# EasyEDA Pro project Arduino SDI.eprj

# Schematic Schematic1

## Sheets
1 SDI: Create Date: 2023-01-01; Page Name: SDI; Project Name: Arduino SDI; Schematic Name: Schematic1; Update Date: 2023-01-05; Add into BOM: yes; Convert to PCB: yes
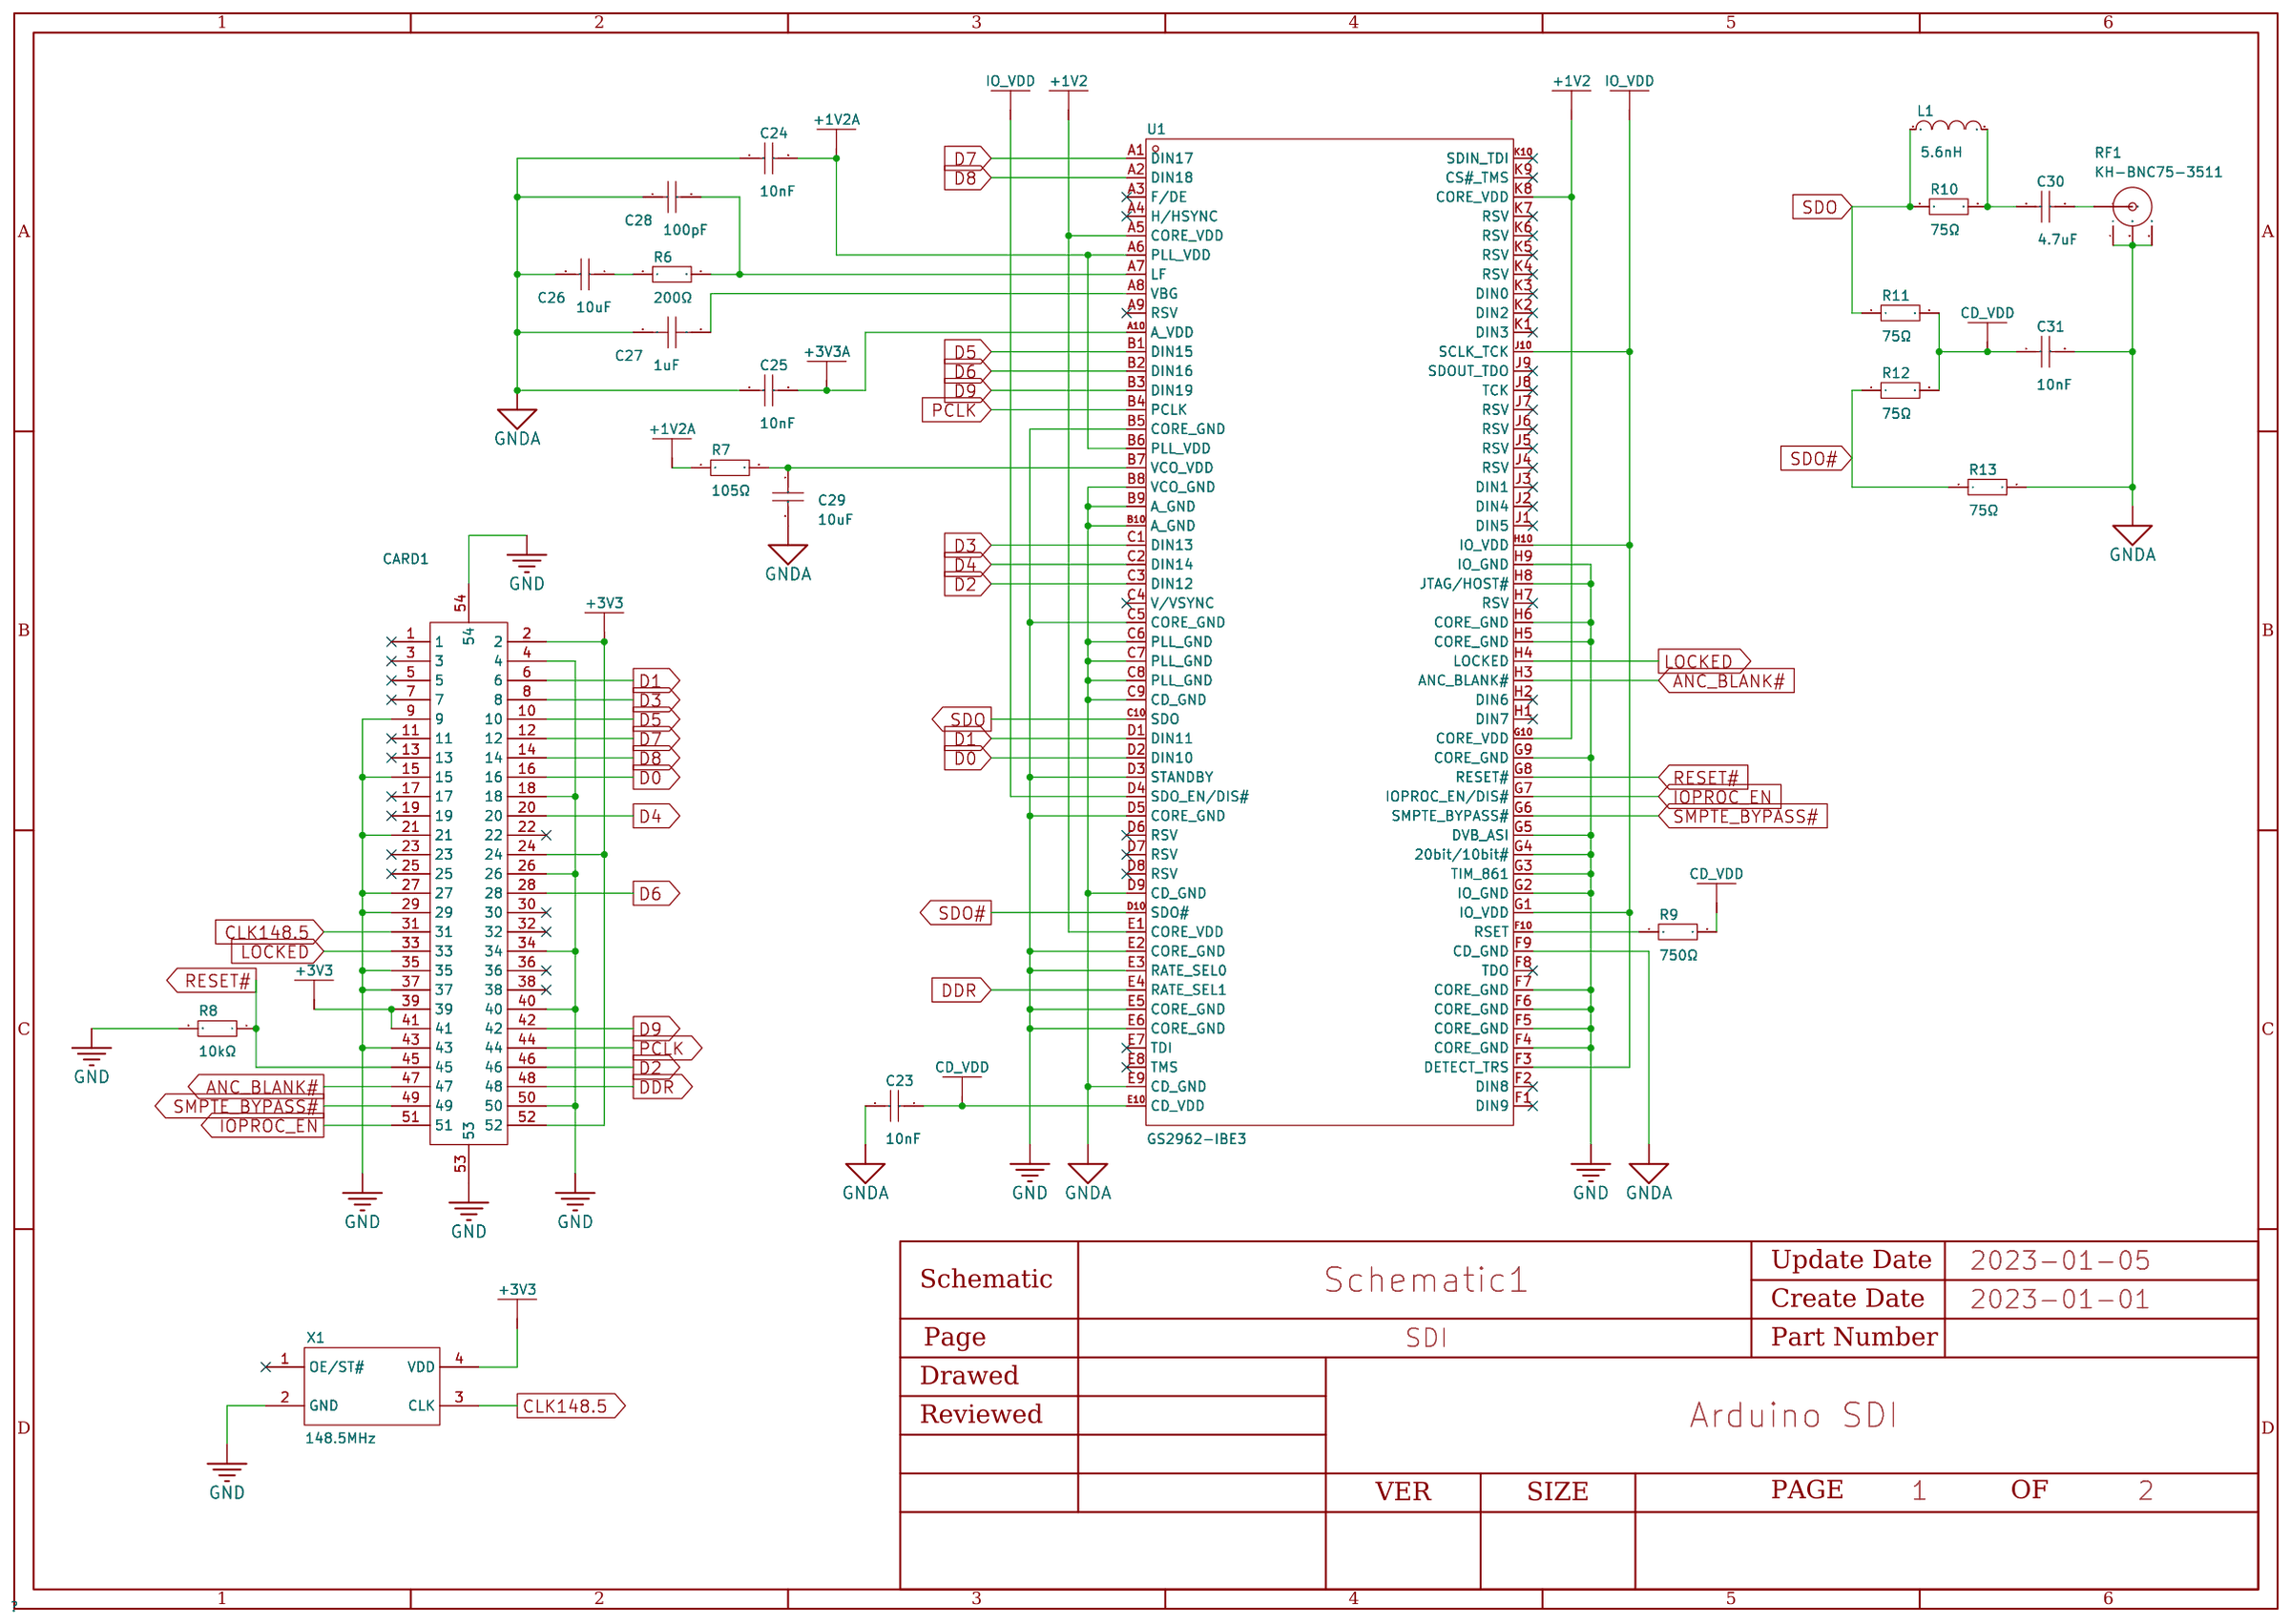
[diagram p0: SDI]
2 Power: Page Name: Power; Update Date: 2023-01-02
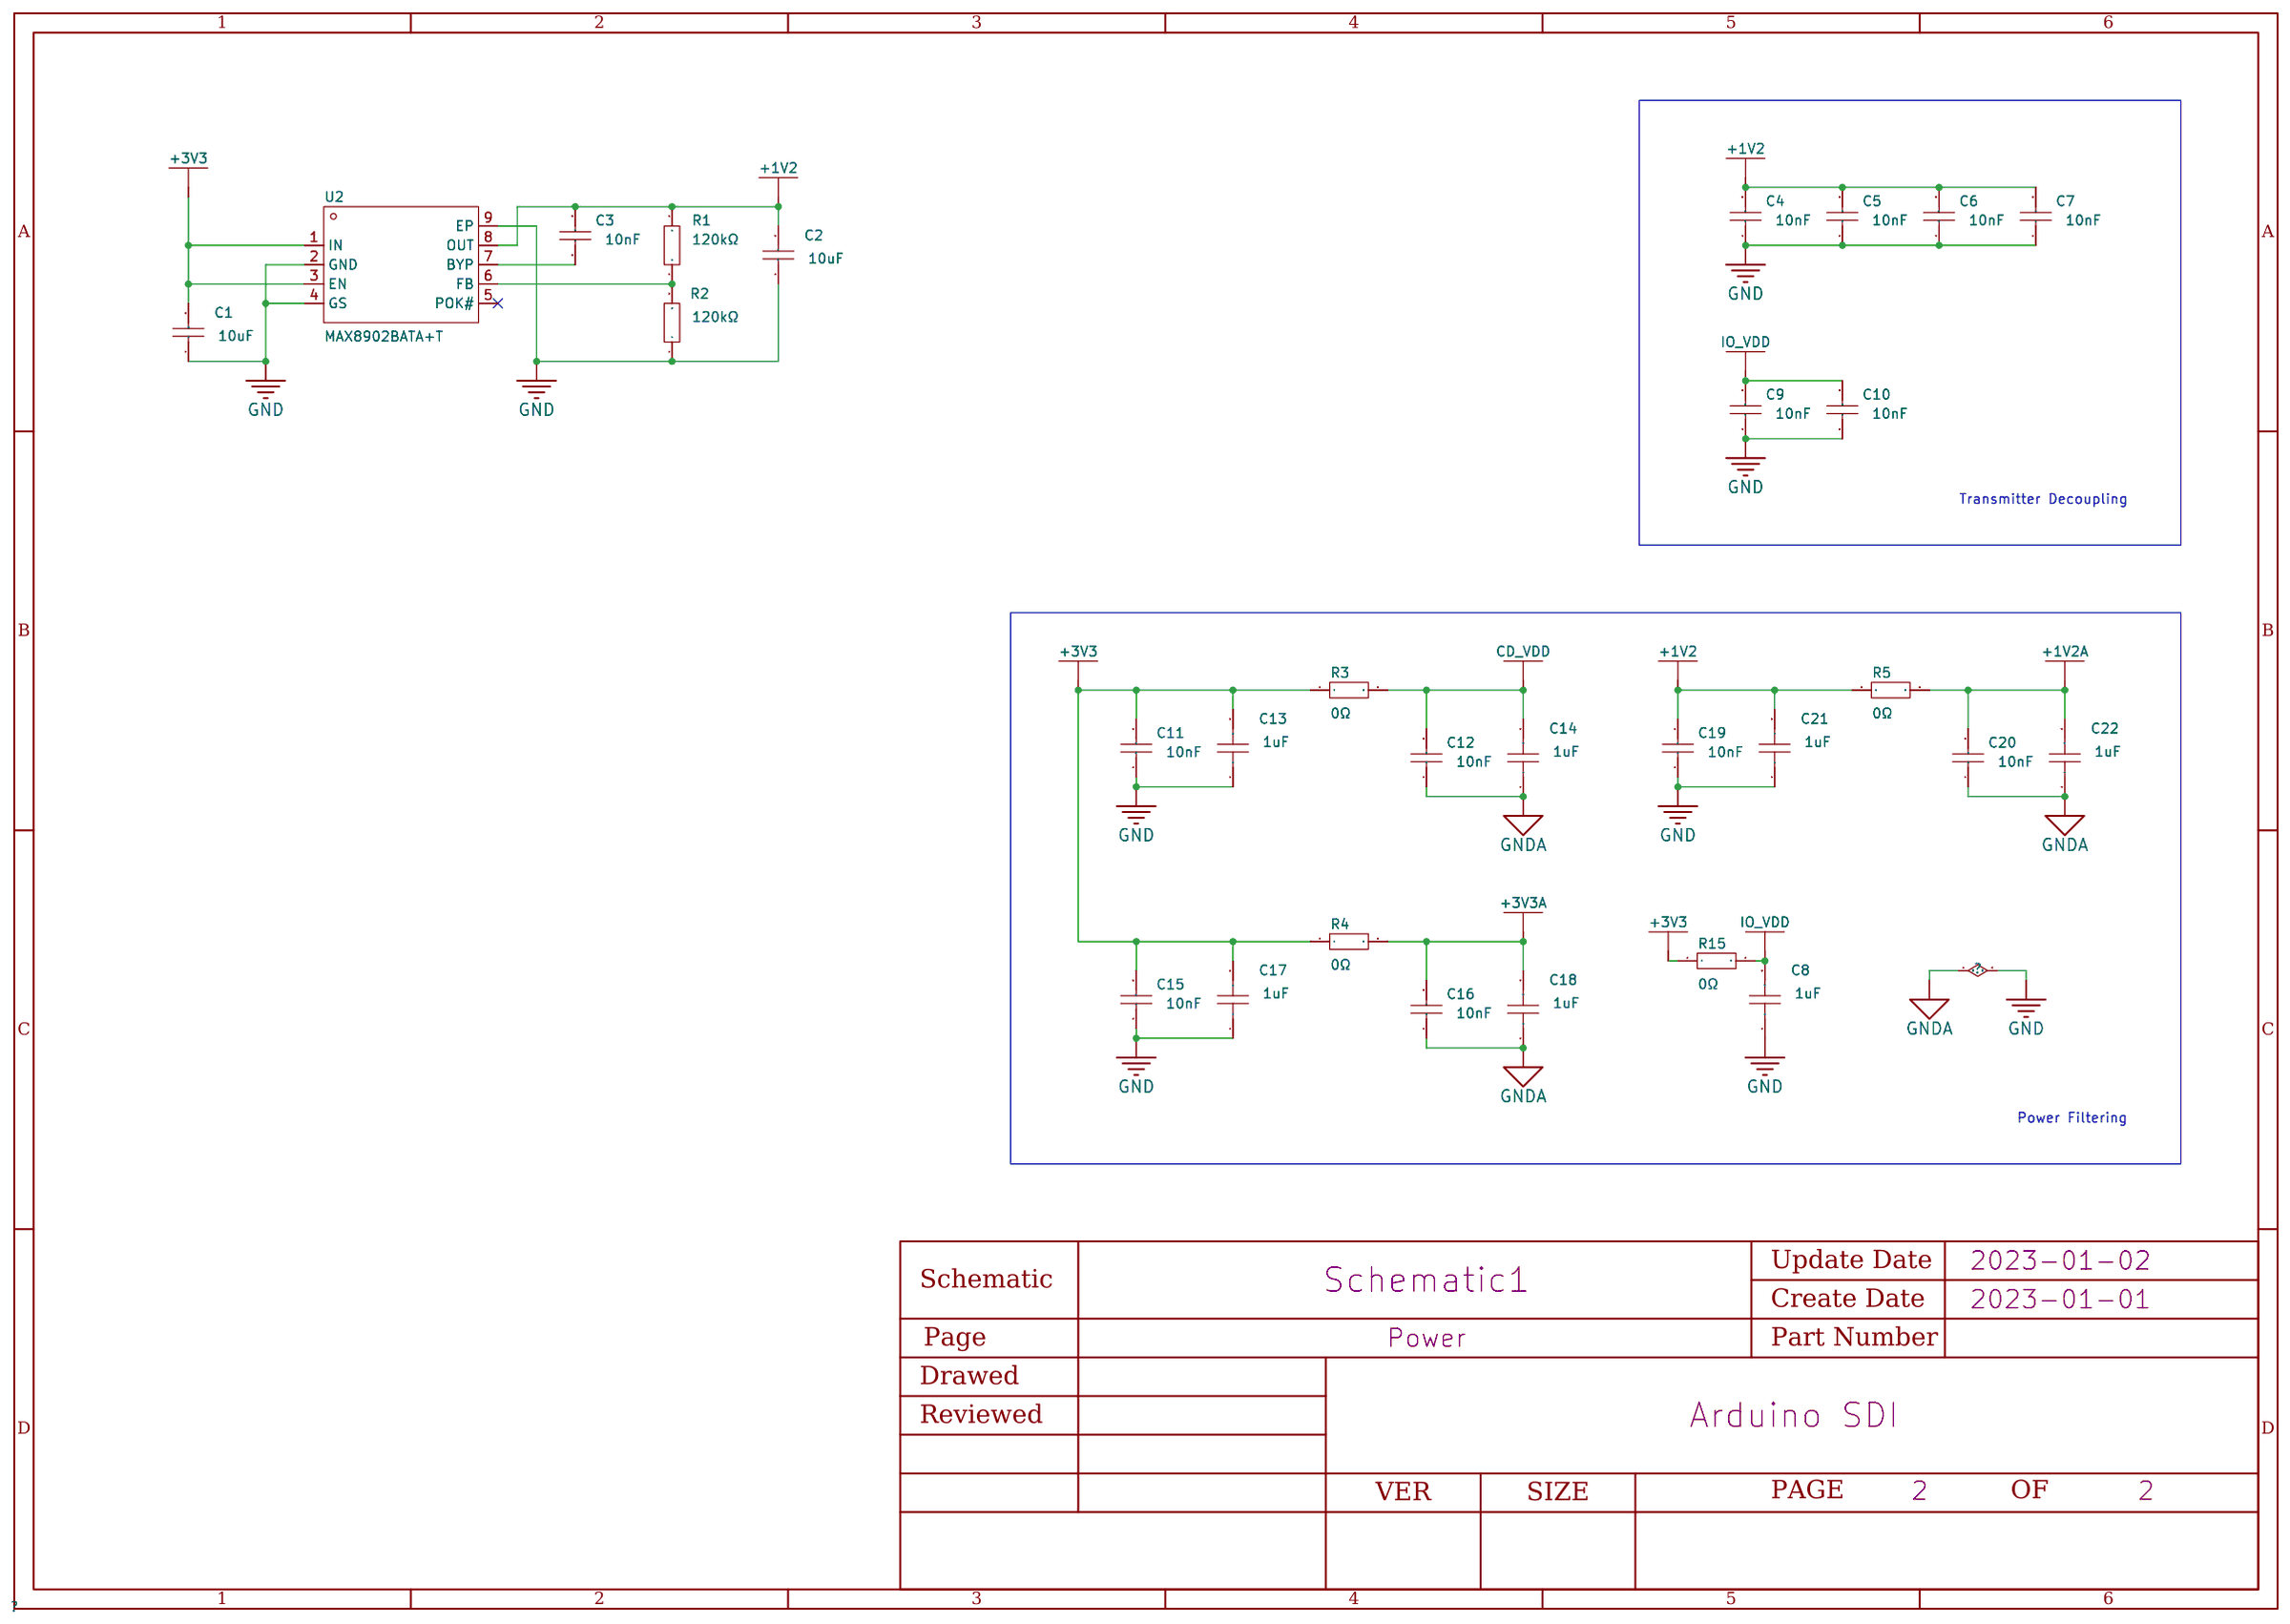
[diagram p1: Power]

## Parts
sheet Power
C1  10uF  [C0402]
C2  10uF  [C0402]
C3  10nF  [C0402]
C4  10nF  [C0402]
C5  10nF  [C0402]
C6  10nF  [C0402]
C7  10nF  [C0402]
C8  1uF  [C0402]
C9  10nF  [C0402]
C10  10nF  [C0402]
C11  10nF  [C0402]
C12  10nF  [C0402]
C13  1uF  [C0402]
C14  1uF  [C0402]
C15  10nF  [C0402]
C16  10nF  [C0402]
C17  1uF  [C0402]
C18  1uF  [C0402]
C19  10nF  [C0402]
C20  10nF  [C0402]
C21  1uF  [C0402]
C22  1uF  [C0402]
R1  120kΩ  [R0402]
R2  120kΩ  [R0402]
R3  0Ω  [R0402]
R4  0Ω  [R0402]
R5  0Ω  [R0402]
R15  0Ω  [R0402]
U2  MAX8902BATA+T  [TDFN-8L_L2.0-W2.0-P0.50-LS2.0-BL-EP]
sheet SDI
C23  10nF  [C0402]
C24  10nF  [C0402]
C25  10nF  [C0402]
C26  10uF  [C0402]
C27  1uF  [C0402]
C28  100pF  [C0402]
C29  10uF  [C0402]
C30  4.7uF  [C0402]
C31  10nF  [C0402]
CARD1  -  [CONN-SMD_PCIE-52P52H]
L1  5.6nH  [IND-SMD_L1.0-W0.5-2]
R6  200Ω  [R0402]
R7  105Ω  [R0402]
R8  10kΩ  [R0402]
R9  750Ω  [R0603]
R10  75Ω  [R0402]
R11  75Ω  [R0402]
R12  75Ω  [R0402]
R13  75Ω  [R0402]
RF1  KH-BNC75-3511  [ANT-TH_KH-BNC75-3511]
U1  GS2962-IBE3  [BGA-100_L11.0-W11.0-R10-C10-P1.00-TL]
X1  148.5MHz  [OSC-SMD_4P-L7.0-W5.0-BL]

## Library data of the parts
C1 C2 C26 C29 = CL05A106MQ5NUNC: Capacitance: Tolerance:±20% Tolerance:±20% Voltage Rated: Temperature Coefficient:; LCSC Part Name: 10uF ±20% 6.3V; Supplier Part: C15525; Manufacturer: SAMSUNG(三星); Supplier Footprint: 0402; Datasheet: https://atta.szlcsc.com/upload/public/pdf/source/20220823/2B02EE04F8F211D38A52DCB16EB6BEBA.pdf; Supplier: LCSC; Tolerance: ±20%
C3-C7 C9-C12 C15 C16 C19 C20 C23-C25 C31 = CL05B103KB5NNNC: Capacitance: Tolerance:±10% Tolerance:±10% Voltage Rated: Temperature Coefficient:; LCSC Part Name: 10nF ±10% 50V; Supplier Part: C15195; Manufacturer: SAMSUNG(三星); Supplier Footprint: 0402; Datasheet: https://atta.szlcsc.com/upload/public/pdf/source/20160103/1457707674468.pdf; Supplier: LCSC; Tolerance: ±10%
C8 C13 C14 C17 C18 C21 C22 C27 = CL05A105KA5NQNC: Capacitance: Tolerance:±10% Tolerance:±10% Voltage Rated: Temperature Coefficient:; LCSC Part Name: 1uF ±10% 25V; Supplier Part: C52923; Manufacturer: SAMSUNG(三星); Supplier Footprint: 0402; Datasheet: https://atta.szlcsc.com/upload/public/pdf/source/20160103/1457707735223.pdf; Supplier: LCSC; Tolerance: ±10%
R1 R2 = 0402WGF1203TCE: Type:Thick Film Resistors Resistance: Tolerance:±1% Tolerance:±1% Power(Watts): Temperature Coefficient:±100ppm/ Temperature Coefficient:±100ppm/ Overload Voltage (Max): Operating Temperature Range:-55~+155 Operating Temperature Range:-55~+155; LCSC Part Name: 120kΩ ±1% 62.5mW; Supplier Part: C25750; Manufacturer: UNI-ROYAL(厚声); Supplier Footprint: 0402; Datasheet: https://atta.szlcsc.com/upload/public/pdf/source/20200306/C422600_1E6D84923E4A46A82E41ADD87F860B5C.pdf; Supplier: LCSC; Type: Thick Film Resistors; Tolerance: ±1%; Temperature Coefficient: ±100ppm/; Operating Temperature Range: -55~+155
R3-R5 R15 = 0402WGF0000TCE: Type:Thick Film Resistors Resistance: Tolerance:±1% Tolerance:±1% Power(Watts): Temperature Coefficient:±800ppm/ Temperature Coefficient:±800ppm/ Overload Voltage (Max): Operating Temperature Range:-55~+155 Operating Temperature Range:-55~+155; LCSC Part Name: 0Ω ±1% 62.5mW; Supplier Part: C17168; Manufacturer: UNI-ROYAL(厚声); Supplier Footprint: 0402; Datasheet: https://atta.szlcsc.com/upload/public/pdf/source/20200306/C422600_1E6D84923E4A46A82E41ADD87F860B5C.pdf; Supplier: LCSC; Type: Thick Film Resistors; Tolerance: ±1%; Temperature Coefficient: ±800ppm/; Operating Temperature Range: -55~+155
U2 = MAX8902BATA+T: Output Type: Output Polarity:Positive Number of Outputs:1 Maximum Input Voltage:5.5V Output Voltage:0.6V~5.3V Output Voltage:0.6V~5.3V Dropout Voltage:120mV@(500mA) Output Current:500mA Power Supply Rejection Ratio (PSRR):92dB@(5kHz),62dB@(100kHz); LCSC Part Name: 正 Vin=5.5V Vout=0.6V~5.3V 500mA 92dB; Supplier Part: C242546; Manufacturer: MAXIM(美信); Supplier Footprint: TDFN-8-EP; JLCPCB Part Class: Extended Part; Datasheet: https://atta.szlcsc.com/upload/public/pdf/source/20180803/C242546_B0413229DCABC6CA257B85DB7A583015.pdf; Supplier: LCSC; Output Polarity: Positive; Number of Outputs: 1; Maximum Input Voltage: 5.5V; Output Voltage: 0.6V~5.3V; Dropout Voltage: 120mV@(500mA); Output Current: 500mA; Power Supply Rejection Ratio (PSRR): 92dB@(5kHz),62dB@(100kHz)
C28 = 0402CG101J500NT: Capacitance: Tolerance:±5% Tolerance:±5% Voltage Rated: Temperature Coefficient:; LCSC Part Name: 100pF ±5% 50V; Supplier Part: C1546; Manufacturer: FH(风华); Supplier Footprint: 0402; Datasheet: https://atta.szlcsc.com/upload/public/pdf/source/20170923/C1546_1506149265265988353.pdf; Supplier: LCSC; Tolerance: ±5%
C30 = CL05A475MP5NRNC: Capacitance: Tolerance:±20% Tolerance:±20% Voltage Rated: Temperature Coefficient:; LCSC Part Name: 4.7uF ±20% 10V; Supplier Part: C23733; Manufacturer: SAMSUNG(三星); Supplier Footprint: 0402; Datasheet: https://atta.szlcsc.com/upload/public/pdf/source/20160103/1457707710457.pdf; Supplier: LCSC; Tolerance: ±20%
CARD1 = PCIE-52P52H: Connector Type:mPCI-E Pitch:0.8mm Number of Pins:52 Mounting Style:Surface Mount Height Above Board:5.2mm Operating Temperature Range:-40~+85 Operating Temperature Range:-40~+85; LCSC Part Name: mPCI-E 0.8mm P数:52; Supplier Part: C266899; Manufacturer: XUNPU(讯普); Supplier Footprint: SMD; Datasheet: https://atta.szlcsc.com/upload/public/pdf/source/20180820/C266899_13151B17022951BC233387EA8773A9D6.pdf; Supplier: LCSC; Connector Type: mPCI-E; Pitch: 0.8mm; Number of Pins: 52; Mounting Style: Surface Mount; Height Above Board: 5.2mm; Operating Temperature Range: -40~+85
L1 = LQW15AN5N6C10D: Inductance: Tolerance: Tolerance: Rated Current: Saturation Current (Isat):- DC Resistance (DCR): Q @ Freq:30@250MHz Frequency - Self Resonant:; LCSC Part Name: 5.6nH ±0.2nH 51mΩ; Supplier Part: C91626; Manufacturer: muRata(村田); Supplier Footprint: 0402; Datasheet: https://atta.szlcsc.com/upload/public/pdf/source/20161226/1482720179870.pdf; Supplier: LCSC; Q @ Freq: 30@250MHz
R6 = 0402WGF2000TCE: Type:Thick Film Resistors Resistance: Tolerance:±1% Tolerance:±1% Power(Watts): Temperature Coefficient:±100ppm/ Temperature Coefficient:±100ppm/ Overload Voltage (Max): Operating Temperature Range:-55~+155 Operating Temperature Range:-55~+155; LCSC Part Name: 200Ω ±1% 62.5mW; Supplier Part: C25087; Manufacturer: UNI-ROYAL(厚声); Supplier Footprint: 0402; Datasheet: https://atta.szlcsc.com/upload/public/pdf/source/20200306/C422600_1E6D84923E4A46A82E41ADD87F860B5C.pdf; Supplier: LCSC; Type: Thick Film Resistors; Tolerance: ±1%; Temperature Coefficient: ±100ppm/; Operating Temperature Range: -55~+155
R7 = 0402WGF1050TCE: Type:Thick Film Resistors Resistance: Tolerance:±1% Tolerance:±1% Power(Watts): Temperature Coefficient:±100ppm/ Temperature Coefficient:±100ppm/ Overload Voltage (Max): Operating Temperature Range:-55~+155 Operating Temperature Range:-55~+155; LCSC Part Name: 105Ω ±1% 62.5mW; Supplier Part: C75737; Manufacturer: UNI-ROYAL(厚声); Supplier Footprint: 0402; Datasheet: https://atta.szlcsc.com/upload/public/pdf/source/20200306/C422600_1E6D84923E4A46A82E41ADD87F860B5C.pdf; Supplier: LCSC; Type: Thick Film Resistors; Tolerance: ±1%; Temperature Coefficient: ±100ppm/; Operating Temperature Range: -55~+155
R8 = 0402WGF1002TCE: Type:Thick Film Resistors Resistance: Tolerance:±1% Tolerance:±1% Power(Watts): Temperature Coefficient:±100ppm/ Temperature Coefficient:±100ppm/ Overload Voltage (Max): Operating Temperature Range:-55~+155 Operating Temperature Range:-55~+155; LCSC Part Name: 10kΩ ±1% 62.5mW; Supplier Part: C25744; Manufacturer: UNI-ROYAL(厚声); Supplier Footprint: 0402; Datasheet: https://atta.szlcsc.com/upload/public/pdf/source/20200306/C422600_1E6D84923E4A46A82E41ADD87F860B5C.pdf; Supplier: LCSC; Type: Thick Film Resistors; Tolerance: ±1%; Temperature Coefficient: ±100ppm/; Operating Temperature Range: -55~+155
R9 = 0603WAF7500T5E: Type:Thick Film Resistors Resistance: Tolerance:±1% Tolerance:±1% Power(Watts): Temperature Coefficient:±100ppm/ Temperature Coefficient:±100ppm/ Overload Voltage (Max): Operating Temperature Range:-55~+155 Operating Temperature Range:-55~+155; LCSC Part Name: 750Ω ±1% 100mW; Supplier Part: C23241; Manufacturer: UNI-ROYAL(厚声); Supplier Footprint: 0603; JLCPCB Part Class: Basic Part; Datasheet: https://atta.szlcsc.com/upload/public/pdf/source/20200306/C422600_1E6D84923E4A46A82E41ADD87F860B5C.pdf; Supplier: LCSC; Type: Thick Film Resistors; Tolerance: ±1%; Temperature Coefficient: ±100ppm/; Operating Temperature Range: -55~+155
R10-R13 = 0402WGF750JTCE: Type:Thick Film Resistors Resistance: Tolerance:±1% Tolerance:±1% Power(Watts): Temperature Coefficient:±100ppm/ Temperature Coefficient:±100ppm/ Overload Voltage (Max): Operating Temperature Range:-55~+155 Operating Temperature Range:-55~+155; LCSC Part Name: 75Ω ±1% 62.5mW; Supplier Part: C25133; Manufacturer: UNI-ROYAL(厚声); Supplier Footprint: 0402; Datasheet: https://atta.szlcsc.com/upload/public/pdf/source/20200306/C422600_1E6D84923E4A46A82E41ADD87F860B5C.pdf; Supplier: LCSC; Type: Thick Film Resistors; Tolerance: ±1%; Temperature Coefficient: ±100ppm/; Operating Temperature Range: -55~+155
RF1 = KH-BNC75-3511: Connector Type:板端 RF Series:BNC Interface Type:内孔 Number of Ports:1 Impedance:75Ω Frequency-Max:3GHz Style:弯头 Interface Diameter:9.5mm Interface Length/Height:- Operating Temperature Range:-55~+155 Operating Temperature Range:-55~+155; LCSC Part Name: BNC 内孔 弯头; Supplier Part: C2837588; Manufacturer: kinghelm(金航标); Supplier Footprint: 插件; Datasheet: https://atta.szlcsc.com/upload/public/pdf/source/20221123/107886A8942993FCB0C00E519661A2AA.pdf; Supplier: LCSC; Connector Type: 板端; RF Series: BNC; Interface Type: 内孔; Number of Ports: 1; Impedance: 75Ω; Frequency-Max: 3GHz; Style: 弯头; Interface Diameter: 9.5mm; Operating Temperature Range: -55~+155
U1 = GS2962-IBE3: Supplier Part: C512365; Manufacturer: SEMTECH; Supplier Footprint: BGA-100; JLCPCB Part Class: Extended Part; Datasheet: https://atta.szlcsc.com/upload/public/pdf/source/20200414/C512365_08B79F50576633EC527E5915302AA3B3.pdf; Supplier: LCSC
X1 = SIT8004AI-82-33E-148.50000Y: Series: Frequency: Frequency Stability:±25ppm Frequency Stability:±25ppm Output Type: Operating Temperature: Operating Temperature:; LCSC Part Name: 148.5MHz 3.3V ±25ppm; Supplier Part: C70733; Manufacturer: SITIME; Supplier Footprint: 7x5mm; JLCPCB Part Class: Extended Part; Datasheet: https://atta.szlcsc.com/upload/public/pdf/source/20161108/1478586439590.pdf; Supplier: LCSC; Frequency Stability: ±25ppm

## Nets
+1V2: C2.2 C3.2 C4.2 C5.2 C6.2 C7.2 C19.2 C21.2 R1.2 R5.1 U1.A5(CORE_VDD) U1.E1(CORE_VDD) U1.G10(CORE_VDD) U1.K8(CORE_VDD) U2.8(OUT)
+1V2A: C20.2 C22.2 C24.2 R5.2 R7.1 U1.A6(PLL_VDD) U1.B6(PLL_VDD)
+3V3: C1.2 C11.2 C13.2 C15.2 C17.2 CARD1.2 CARD1.24 CARD1.39 CARD1.41 CARD1.52 R3.1 R4.1 R15.1 U2.1(IN) U2.3(EN) X1.4(VDD)
+3V3A: C16.2 C18.2 C25.2 R4.2 U1.A10(A_VDD)
GND: C1.1 C2.1 C4.1 C5.1 C6.1 C7.1 C8.1 C9.1 C10.1 C11.1 C12.1 C13.1 C14.1 C15.1 C16.1 C17.1 C18.1 C19.1 C20.1 C21.1 C22.1 C23.1 C24.1 C25.1 C26.2 C27.2 C28.1 C29.2 C31.2 CARD1.4 CARD1.9 CARD1.15 CARD1.18 CARD1.21 CARD1.26 CARD1.27 CARD1.29 CARD1.34 CARD1.35 CARD1.37 CARD1.40 CARD1.43 CARD1.50 CARD1.53 CARD1.54 R2.1 R8.2 R13.2 RF1.2 RF1.3 RF1.4 U1.B5(CORE_GND) U1.B8(VCO_GND) U1.B9(A_GND) U1.B10(A_GND) U1.C5(CORE_GND) U1.C6(PLL_GND) U1.C7(PLL_GND) U1.C8(PLL_GND) U1.C9(CD_GND) U1.D3(STANDBY) U1.D5(CORE_GND) U1.D9(CD_GND) U1.E2(CORE_GND) U1.E3(RATE_SEL0) U1.E5(CORE_GND) U1.E6(CORE_GND) U1.E9(CD_GND) U1.F4(CORE_GND) U1.F5(CORE_GND) U1.F6(CORE_GND) U1.F7(CORE_GND) U1.F9(CD_GND) U1.G2(IO_GND) U1.G3(TIM_861) U1.G4(20bit/10bit#) U1.G5(DVB_ASI) U1.G9(CORE_GND) U1.H5(CORE_GND) U1.H6(CORE_GND) U1.H8(JTAG/HOST#) U1.H9(IO_GND) U2.2(GND) U2.4(GS) U2.9(EP) X1.2(GND)
ANC_BLANK#: CARD1.47 U1.H3(ANC_BLANK#)
CD_VDD: C12.2 C14.2 C23.2 C31.1 R3.2 R9.2 R11.2 R12.2 U1.E10(CD_VDD)
CLK148.5: CARD1.31 X1.3(CLK)
D0: CARD1.16 U1.D2(DIN10)
D1: CARD1.6 U1.D1(DIN11)
D2: CARD1.46 U1.C3(DIN12)
D3: CARD1.8 U1.C1(DIN13)
D4: CARD1.20 U1.C2(DIN14)
D5: CARD1.10 U1.B1(DIN15)
D6: CARD1.28 U1.B2(DIN16)
D7: CARD1.12 U1.A1(DIN17)
D8: CARD1.14 U1.A2(DIN18)
D9: CARD1.42 U1.B3(DIN19)
DDR: CARD1.48 U1.E4(RATE_SEL1)
IO_VDD: C8.2 C9.2 C10.2 R15.2 U1.D4(SDO_EN/DIS#) U1.F3(DETECT_TRS) U1.G1(IO_VDD) U1.H10(IO_VDD) U1.J10(SCLK_TCK)
IOPROC_EN: CARD1.51 U1.G7(IOPROC_EN/DIS#)
LOCKED: CARD1.33 U1.H4(LOCKED)
PCLK: CARD1.44 U1.B4(PCLK)
RESET#: CARD1.45 R8.1 U1.G8(RESET#)
SDO: L1.1 R10.1 R11.1 U1.C10(SDO)
SDO#: R12.1 R13.1 U1.D10(SDO#)
SMPTE_BYPASS#: CARD1.49 U1.G6(SMPTE_BYPASS#)
$1N18162: C26.1 R6.1
$1N18693: C27.1 U1.A8(VBG)
$1N18791: C28.2 R6.2 U1.A7(LF)
$1N19933: C29.1 R7.2 U1.B7(VCO_VDD)
$1N24621: R9.1 U1.F10(RSET)
$1N26341: C30.2 RF1.1(OUT)
$1N26857: C30.1 L1.2 R10.2
$2N832: C3.1 U2.7(BYP)
$2N1175: R1.1 R2.2 U2.6(FB)

Not connected (* = marked no-connect by the designer): CARD1 1* 3* 5* 7* 11* 13* 17* 19* 22* 23* 25* 30* 32* 36* 38*; U1 A3(F/DE)* A4(H/HSYNC)* A9(RSV)* C4(V/VSYNC)* D6(RSV)* D7(RSV)* D8(RSV)* E7(TDI)* E8(TMS)* F1(DIN9)* F2(DIN8)* F8(TDO)* H1(DIN7)* H2(DIN6)* H7(RSV)* J1(DIN5)* J2(DIN4)* J3(DIN1)* J4(RSV)* J5(RSV)* J6(RSV)* J7(RSV)* J8(TCK)* J9(SDOUT_TDO)* K1(DIN3)* K2(DIN2)* K3(DIN0)* K4(RSV)* K5(RSV)* K6(RSV)* K7(RSV)* K9(CS#_TMS)* K10(SDIN_TDI)*; U2 5(POK#)*; X1 1(OE/ST#)*

## Notes on the sheets
sheet 2
- Transmitter Decoupling
- Power Filtering

# Board PCB1
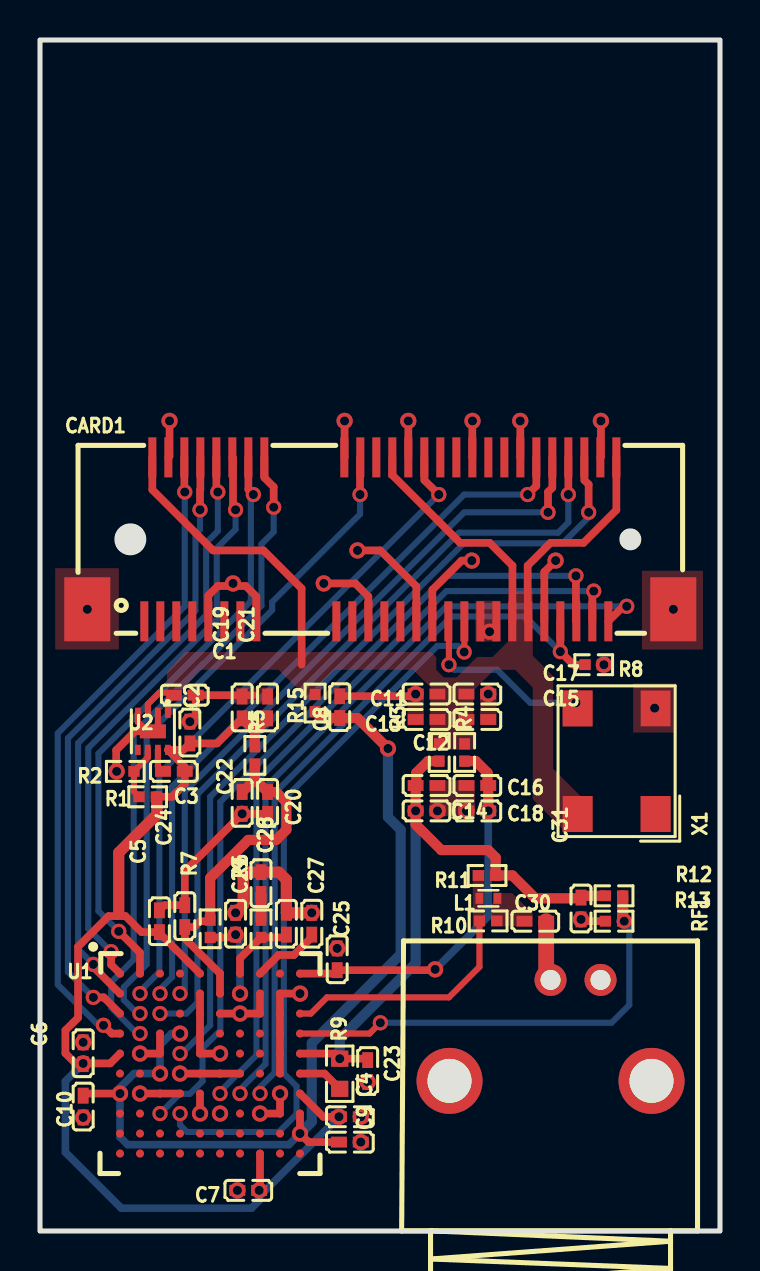
[diagram p2: board, top side]
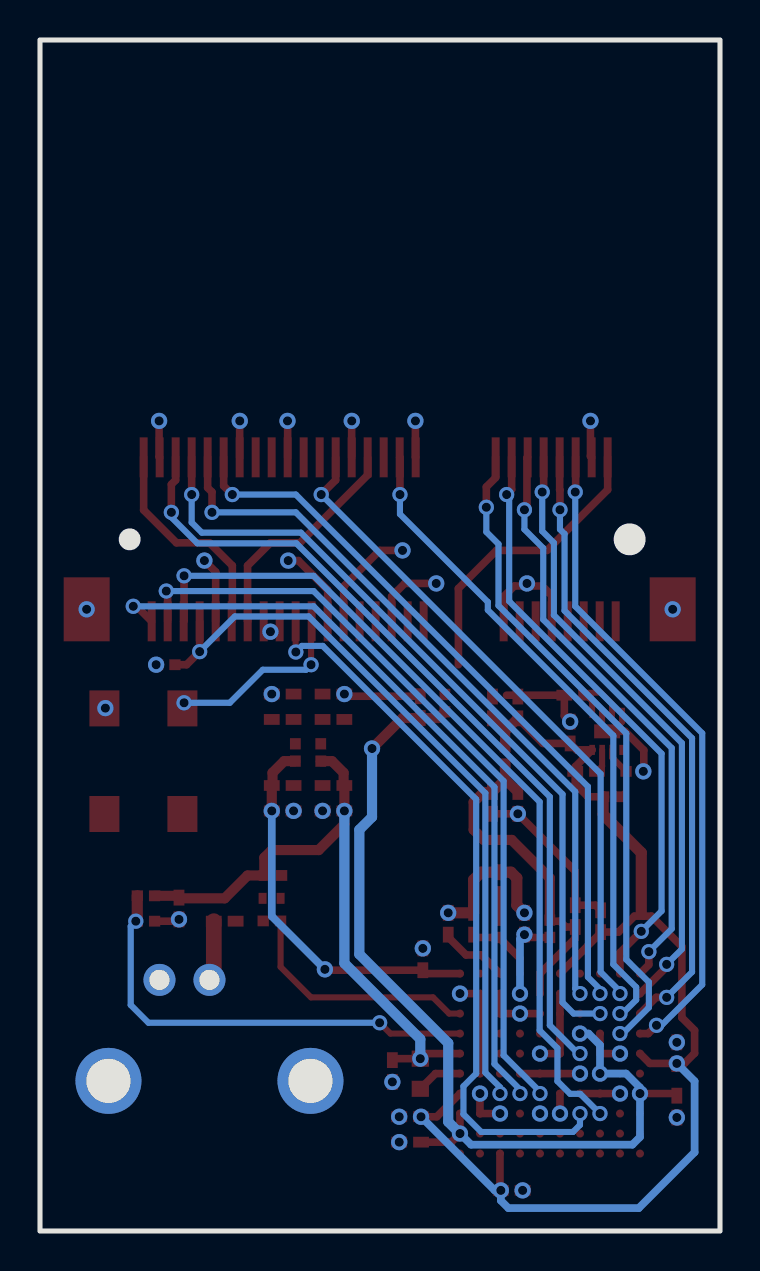
[diagram p3: board, bottom side, seen from below]

Outline 34 x 59.56 mm; copper layers: Top Layer, Inner1, Inner2, Bottom Layer. Coordinates in mm from the lower left corner of the outline.
Outline path: rectangle 0,59.56 34,0
Stack: Top Layer 0.035mm / Dielectric1 0.48mm PP er 4.5 / Inner1 0.035mm / Dielectric2 0.48mm FR4 er 4.5 / Inner2 0.035mm / Dielectric3 0.48mm PP er 4.5 / Bottom Layer 0.035mm

## Design rules (mm)
spacing safeClearance (default): track to track 0.152, other pairs 0.152 to 0.3
track width trackWidth (default): min 0.127, default 0.254, max 2.54
differential pair differentialPair (default): width min 0.127, default 0.254, max 2.54; gap min 0.152, default 0.152
via viaSize (default): diameter min 0.5, default 0.61, max 10; hole min 0.3, default 0.305, max 6

## Placement (name value [footprint] x y rotation side)
C1  10uF  [C0402]  7.24 26.8 180 top
C2  10uF  [C0402]  7.49 24.93 270 top
C3  10nF  [C0402]  6.69 22.99 0 top
C4  10nF  [C0402]  15.49 5.71 180 top
C5  10nF  [C0402]  5.97 15.49 270 top
C6  10nF  [C0402]  2.16 8.89 270 top
C7  10nF  [C0402]  10.41 2.03 0 top
C8  1uF  [C0402]  14.99 26.2 270 top
C9  10nF  [C0402]  15.49 4.44 180 top
C10  10nF  [C0402]  2.16 6.22 90 top
C11  10nF  [C0402]  19.33 26.85 0 top
C12  10nF  [C0402]  19.33 22.28 180 top
C13  1uF  [C0402]  19.33 25.58 0 top
C14  1uF  [C0402]  19.33 21.01 180 top
C15  10nF  [C0402]  21.87 25.58 180 top
C16  10nF  [C0402]  21.87 22.28 0 top
C17  1uF  [C0402]  21.87 26.85 180 top
C18  1uF  [C0402]  21.87 21.01 0 top
C19  10nF  [C0402]  10.11 26.18 270 top
C20  10nF  [C0402]  11.38 21.41 90 top
C21  1uF  [C0402]  11.38 26.18 270 top
C22  1uF  [C0402]  10.11 21.41 90 top
C23  10nF  [C0402]  16.38 8 90 top
C24  10nF  [C0402]  7.24 15.75 270 top
C25  10nF  [C0402]  14.86 13.59 270 top
C26  10uF  [C0402]  11.05 17.4 90 top
C27  1uF  [C0402]  13.59 15.37 90 top
C28  100pF  [C0402]  12.32 15.37 270 top
C29  10uF  [C0402]  9.78 15.37 90 top
C30  4.7uF  [C0402]  24.76 15.49 0 top
C31  10nF  [C0402]  27.05 16.13 270 top
CARD1  -  [CONN-SMD_PCIE-52P52H]  17.02 34.59 0 top
L1  5.6nH  [IND-SMD_L1.0-W0.5-2]  22.42 16.64 0 top
R1  120kΩ  [R0402]  5.39 21.72 0 top
R2  120kΩ  [R0402]  4.27 22.99 0 top
R3  0Ω  [R0402]  19.96 23.93 270 top
R4  0Ω  [R0402]  21.23 23.93 270 top
R5  0Ω  [R0402]  10.74 23.78 270 top
R6  200Ω  [R0402]  11.05 15.11 270 top
R7  105Ω  [R0402]  8.51 15.11 270 top
R8  10kΩ  [R0402]  27.69 28.32 0 top
R9  750Ω  [R0603]  14.99 7.87 90 top
R10  75Ω  [R0402]  22.41 15.51 0 top
R11  75Ω  [R0402]  22.35 17.78 0 top
R12  75Ω  [R0402]  28.7 16.76 180 top
R13  75Ω  [R0402]  28.7 15.49 180 top
R15  0Ω  [R0402]  13.75 26.4 270 top
RF1  KH-BNC75-3511  [ANT-TH_KH-BNC75-3511]  25.53 10.03 0 top
U1  GS2962-IBE3  [BGA-100_L11.0-W11.0-R10-C10-P1.00-TL]  8.5 8.37 0 top
U2  MAX8902BATA+T  [TDFN-8L_L2.0-W2.0-P0.50-LS2.0-BL-EP]  5.64 24.99 180 top
X1  148.5MHz  [OSC-SMD_4P-L7.0-W5.0-BL]  28.83 23.49 90 top

## Footprints (pads in the part's own frame, mm; a bottom-side part is the same pattern mirrored in y, then rotated)
ANT-TH_KH-BNC75-3511
  round 1.6 hole 1: 1(0,2.525) 2(2.5,2.525)
  round 3.3 hole 2.2: 3(5.05,-2.525) 4(-5.05,-2.525)
BGA-100_L11.0-W11.0-R10-C10-P1.00-TL
  round 0.4 smd: A1(-4.5,4.5) A2(-3.5,4.5) A3(-2.5,4.5) A4(-1.5,4.5) A5(-0.5,4.5) A6(0.5,4.5) A7(1.5,4.5) A8(2.5,4.5) A9(3.5,4.5) A10(4.5,4.5) B1(-4.5,3.5) B2(-3.5,3.5) B3(-2.5,3.5) B4(-1.5,3.5) B5(-0.5,3.5) B6(0.5,3.5) B7(1.5,3.5) B8(2.5,3.5) B9(3.5,3.5) B10(4.5,3.5) C1(-4.5,2.5) C2(-3.5,2.5) C3(-2.5,2.5) C4(-1.5,2.5) C5(-0.5,2.5) C6(0.5,2.5) C7(1.5,2.5) C8(2.5,2.5) C9(3.5,2.5) C10(4.5,2.5) D1(-4.5,1.5) D2(-3.5,1.5) D3(-2.5,1.5) D4(-1.5,1.5) D5(-0.5,1.5) D6(0.5,1.5) D7(1.5,1.5) D8(2.5,1.5) D9(3.5,1.5) D10(4.5,1.5) E1(-4.5,0.5) E2(-3.5,0.5) E3(-2.5,0.5) E4(-1.5,0.5) E5(-0.5,0.5) E6(0.5,0.5) E7(1.5,0.5) E8(2.5,0.5) E9(3.5,0.5) E10(4.5,0.5) F1(-4.5,-0.5) F2(-3.5,-0.5) F3(-2.5,-0.5) F4(-1.5,-0.5) F5(-0.5,-0.5) F6(0.5,-0.5) F7(1.5,-0.5) F8(2.5,-0.5) F9(3.5,-0.5) F10(4.5,-0.5) G1(-4.5,-1.5) G2(-3.5,-1.5) G3(-2.5,-1.5) G4(-1.5,-1.5) G5(-0.5,-1.5) G6(0.5,-1.5) G7(1.5,-1.5) G8(2.5,-1.5) G9(3.5,-1.5) G10(4.5,-1.5) H1(-4.5,-2.5) H2(-3.5,-2.5) H3(-2.5,-2.5) H4(-1.5,-2.5) H5(-0.5,-2.5) H6(0.5,-2.5) H7(1.5,-2.5) H8(2.5,-2.5) H9(3.5,-2.5) H10(4.5,-2.5) J1(-4.5,-3.5) J2(-3.5,-3.5) J3(-2.5,-3.5) J4(-1.5,-3.5) J5(-0.5,-3.5) J6(0.5,-3.5) J7(1.5,-3.5) J8(2.5,-3.5) J9(3.5,-3.5) J10(4.5,-3.5) K1(-4.5,-4.5) K2(-3.5,-4.5) K3(-2.5,-4.5) K4(-1.5,-4.5) K5(-0.5,-4.5) K6(0.5,-4.5) K7(1.5,-4.5) K8(2.5,-4.5) K9(3.5,-4.5) K10(4.5,-4.5)
C0402
  rect 0.79x0.54 smd: 1(-0.545,0) 2(0.545,0)
CONN-SMD_PCIE-52P52H
  rect 0.399x1.999 smd: 1(-11.801,-4.099) 2(-11.399,4.099) 3(-11.001,-4.099) 4(-10.6,4.099) 5(-10.2,-4.099) 6(-9.8,4.099) 7(-9.4,-4.099) 8(-8.999,4.099) 9(-8.601,-4.099) 10(-8.199,4.099) 11(-7.801,-4.099) 12(-7.399,4.099) 13(-7,-4.099) 14(-6.599,4.099) 15(-6.2,-4.099) 16(-5.799,4.099) 17(-2.2,-4.099) 18(-1.801,4.099) 19(-1.399,-4.099) 20(-1.001,4.099) 21(-0.6,-4.099) 22(-0.201,4.099) 23(0.201,-4.099) 24(0.6,4.099) 25(1.001,-4.099) 26(1.399,4.099) 27(1.801,-4.099) 28(2.2,4.099) 29(2.601,-4.099) 30(2.999,4.099) 31(3.401,-4.099) 32(3.8,4.099) 33(4.201,-4.099) 34(4.6,4.099) 35(5.002,-4.099) 36(5.4,4.099) 37(5.799,-4.099) 38(6.2,4.099) 39(6.599,-4.099) 40(7,4.099) 41(7.399,-4.099) 42(7.801,4.099) 43(8.199,-4.099) 44(8.601,4.099) 45(8.999,-4.099) 46(9.4,4.099) 47(9.8,-4.099) 48(10.2,4.099) 49(10.6,-4.099) 50(11.001,4.099) 51(11.399,-4.099) 52(11.801,4.099)
  rect 2.301x3.2 smd: 53(14.65,-3.5) 54(-14.65,-3.5)
IND-SMD_L1.0-W0.5-2
  rect 0.4x0.55 smd: 1(-0.45,0) 2(0.45,0)
OSC-SMD_4P-L7.0-W5.0-BL
  rect 1.8x1.5 smd: 1(-2.64,-1.95) 2(2.64,-1.95) 3(2.64,1.95) 4(-2.64,1.95)
R0402
  rect 0.566x0.54 smd: 1(-0.433,0) 2(0.433,0)
R0603
  rect 0.806x0.864 smd: 1(-0.753,0) 2(0.753,0)
TDFN-8L_L2.0-W2.0-P0.50-LS2.0-BL-EP
  rect 0.28x0.505 smd: 1(-0.75,-0.927) 2(-0.25,-0.927) 3(0.25,-0.927) 4(0.75,-0.927) 5(0.75,0.927) 6(0.25,0.927) 7(-0.25,0.927) 8(-0.75,0.927)
  rect 1.3x0.7 smd: 9(0,0)

## Nets
As in the schematic.

Pads without a net: CARD1 1 3 5 7 11 13 17 19 22 23 25 30 32 36 38; U1 A3 A4 A9 C4 D6 D7 D8 E7 E8 F1 F2 F8 H1 H2 H7 J1 J2 J3 J4 J5 J6 J7 J8 J9 K1 K2 K3 K4 K5 K6 K7 K9 K10; U2 5; X1 1

## Via types
v1: diameter 0.813, hole 0.457, Top Layer to Bottom Layer, 57 vias
v2: diameter 0.762, hole 0.457, Top Layer to Bottom Layer, 38 vias

## Routing (per net, layer and track width the routed paths; a pad name or vN(x,y) marks a point on that pad's centre or on a via; arc(x,y) is an arc through that point)
+1V2: length 60.3
  Top Layer w0.381: C19.2 8.85,24.38 C2.2 7.17,24.06 U2.8 7.24,23.22 7.24,22.35 6.6,21.72 5.82,21.72 ; 3.94,15.87 3.81,15.75 ; 3.81,15.75 3.43,15.75 1.91,14.22 1.91,10.67 1.27,10.03 1.27,8.89 1.78,8.38 v1(2.16,8.38) 3.51,8.38 U1.E1 ; 3.81,15.75 4.28,15.75 5.08,14.95 C5.2 5.97,14.91 U1.A5 ; v1(10.96,2.03) 11,2.07 U1.K8 ; U1.G10 14.16,5.71 v1(14.95,5.71)
  Top Layer w0.508: 10.74,25 C21.2 ; 10.74,25 C19.2 ; 10.74,25 R5.1
  Top Layer w0.559: 3.94,15.87 3.94,18.92 5.84,20.83 5.84,21.69 5.82,21.72
  Bottom Layer w0.381: v1(14.95,5.71) 11.27,2.03 v1(10.96,2.03) 10.96,1.52 10.58,1.14 4.06,1.14 1.27,3.94 1.27,7.49 v1(2.16,8.38)
+1V2A: length 17.5
  Top Layer w0.381: R7.1 8.46,15.49 8,15.49 7.71,15.2 C24.2 7.24,14.64 U1.A6 U1.B6
  Top Layer w0.508: 10.74,22.59 C22.2 ; 10.74,22.59 C20.2 11.81,21.95 12.32,21.45 12.32,20.07 11.81,19.56 10.41,19.56 8.51,17.65 R7.1 ; 10.74,22.59 R5.2
+3V3: length 40.1
  Top Layer w0.305: 6.35,26.92 5.97,26.92 5.39,26.35 U2.3 ; U2.1 6.39,26.5 C1.2
  Top Layer w0.381: CARD1.52 28.82,36.06 27.18,34.42 25.53,34.42 24.38,33.27 24.38,30.52 CARD1.41 ; CARD1.39 23.62,30.5 23.62,33.27 22.48,34.42 21.01,34.42 17.62,37.81 CARD1.24 ; CARD1.2 5.62,37.07 8.65,34.04 11.18,34.04 13.08,32.13 13.08,28.32
+3V3A: length 19.2
  Top Layer w0.381: U1.A10 14.69,12.87 C25.2 19.71,13.04 v1(19.76,13.09)
  Top Layer w0.508: v1(22.41,21.01) C16.2 22.37,22.32 22.37,22.92 21.79,23.5 R4.2
  Bottom Layer w0.381: v1(22.41,21.01) 22.41,15.74 v1(19.76,13.09)
GND: length 85.6
  Top Layer w0.305: U2.2 5.89,25.24 U2.9 ; U2.4 4.89,25.46 5.36,24.99
  Top Layer w0.381: C5.1 6.22,16.29 C24.1 7.24,18 v1(10.11,20.86) C20.1 ; v1(7.49,25.47) 7.78,25.77 C1.1 10.67,26.8 ; v1(13,11.87) U1.B9 U1.C9 U1.D9 U1.E9 U1.F9 ; v1(18.41,40.51) 18.42,40.51 CARD1.26 ; v1(5,6.87) U1.G3 U1.G4 ; v1(25.78,33.53) 25.22,32.96 CARD1.43 ; v1(9,8.87) U1.E5 U1.D5 U1.C5 U1.B5 ; U1.G5 v1(8,5.87) ; CARD1.29 19.62,32.06 21.08,33.53 v1(21.59,33.53) ; 24.02,38.69 24.02,40.51 v1(24.01,40.51) ; U1.D3 U1.E3 v1(5,8.87) ; CARD1.18 15.23,38.7 v1(15.23,40.51) ; U2.9 4.75,24.99 3.81,24.05 3.81,23.01 v1(3.83,22.99) ; CARD1.15 10.82,31.73 10.29,32.26 9.78,32.26 v1(9.65,32.38) 9.53,32.26 8.89,32.26 8.42,31.78 CARD1.9 ; v1(28.04,40.51) 28.04,38.72 CARD1.50 ; v1(21.62,40.51) 21.62,40.51 CARD1.34 ; CARD1.21 16.42,31.73 15.76,32.38 v1(14.19,32.38) ; U1.F7 U1.F6 U1.F5 v1(7,7.87) ; R13.2 27.14,15.49 v1(27.05,15.58) ; v1(6.48,40.51) 6.48,38.75 CARD1.4 ; U1.B8 U1.C8 v1(10,10.87) U1.C6 ; v1(18.78,26.85) 18.67,26.74 C8.1 ; v1(15.88,34.04) 17.02,34.04 18.82,32.24 CARD1.27 ; v1(11,5.87) U1.H9 v1(12,6.87)
  Top Layer w0.559: v1(9.78,15.91) 10.16,16.29 10.16,17.65 10.45,17.94 C26.2 11.94,17.94 12.32,17.57 C28.1 v1(13.59,15.91)
  vias: v1(2.16,9.44) v1(2.16,5.68) v1(2.37,31.09) v1(9,5.87) v1(9.87,2.03) v1(14.86,14.13) v1(16.04,5.71) v1(16.04,4.44) v1(16.38,7.46) v1(19.87,21.01) v1(21.32,21.01) v1(22.41,26.85) v1(22.48,29.97) v1(28.19,28.32) v1(30.73,26.15) v1(31.67,31.09)
ANC_BLANK#: length 41.9
  Top Layer w0.381: v2(26.8,32.77) 26.8,30.51 CARD1.47
  Bottom Layer w0.305: v2(26.8,32.77) 20.32,32.77 9.02,21.46 9.02,10.03 8.13,9.14 8.13,7.49 7.49,6.86 6.99,6.86 v2(6,5.87)
CD_VDD: length 33.1
  Top Layer w0.381: U1.E10 14.73,8.87 v1(14.99,8.62) 16.31,8.62 16.38,8.55
  Top Layer w0.508: R3.2 19.4,23.5 18.82,22.92 18.82,22.32 C12.2 v1(18.78,21.01) 18.78,20.33 20.07,19.05 22.41,19.05 22.78,18.67 R11.2 23.62,17.78 24.76,16.64 27.01,16.64 C31.1 27.14,16.76 R12.2
  Bottom Layer w0.508: v1(18.78,21.01) 18.78,13.39 14.99,9.6 v1(14.99,8.62)
CLK148.5: length 9.3
  Top Layer w0.305: CARD1.31 20.45,30.46 v2(20.45,28.32)
  Bottom Layer w0.305: v2(26.8,26.42) 24.51,26.42 22.86,28.07 20.7,28.07 v2(20.45,28.32)
D0: length 33.1
  Top Layer w0.381: CARD1.16 11.22,37.68 11.68,37.21 v2(11.68,36.19)
  Bottom Layer w0.305: v2(5,9.87) 4.86,9.87 3.56,11.18 3.56,12.45 4.69,13.58 4.69,24.89 11.07,31.27 11.07,34.35 11.68,34.96 v2(11.68,36.19)
D1: length 33.1
  Top Layer w0.381: CARD1.6 7.22,36.98 v2(7.24,36.96) ; v2(3.18,10.29) 3.59,9.87 U1.D1
  Bottom Layer w0.305: v2(7.24,36.96) 7.24,31.24 0.89,24.89 0.89,12.32 2.92,10.29 v2(3.18,10.29)
D2: length 39.9
  Top Layer w0.381: 26.42,36.83 CARD1.46
  Bottom Layer w0.305: v2(26.42,36.83) 26.42,35.43 25.91,34.92 20.96,34.92 7.87,21.84 7.87,11.43 7.32,10.87 v2(6,10.87)
D3: length 31.9
  Top Layer w0.381: v2(2.67,11.68) 3.19,11.68 U1.C1 ; v2(8,36.07) 8,37.05 8.02,37.06 CARD1.8
  Bottom Layer w0.305: v2(8,36.07) 8,35.09 7.77,34.86 7.77,31.02 1.4,24.65 1.4,12.95 v2(2.67,11.68)
D4: length 33.1
  Top Layer w0.381: v2(16,36.83) 16,38.68 CARD1.20
  Bottom Layer w0.305: v2(5,10.87) 4.87,10.87 4.19,11.56 4.19,12.19 5.33,13.33 5.33,24.78 11.61,31.05 11.61,31.46 16,35.85 v2(16,36.83)
D5: length 30.6
  Top Layer w0.381: CARD1.10 8.82,37.03 v2(8.89,36.96) ; v2(2.67,13.33) 2.67,13.21 U1.B1
  Bottom Layer w0.305: v2(8.89,36.96) 8.89,35 8.31,34.42 8.31,30.8 1.91,24.4 1.91,14.1 v2(2.67,13.33)
D6: length 33.3
  Top Layer w0.381: v2(19.94,36.83) 19.22,37.55 CARD1.28
  Bottom Layer w0.305: v2(19.94,36.83) 5.97,22.86 5.97,12.95 5,11.99 v2(5,11.87)
D7: length 29.6
  Top Layer w0.381: CARD1.12 9.65,38.66 9.65,36.19 v2(9.78,36.07) ; U1.A1 3.56,13.32 v2(3.56,13.97)
  Bottom Layer w0.305: v2(3.56,13.97) 2.41,15.11 2.41,24.15 8.84,30.58 8.84,34.15 9.78,35.09 v2(9.78,36.07)
D8: length 30
  Top Layer w0.381: CARD1.14 10.42,37.08 v2(10.67,36.83) ; v2(3.94,14.99) 5,13.92 U1.A2
  Bottom Layer w0.305: v2(3.94,14.99) 2.92,16 2.92,23.88 10.54,31.5 10.54,36.7 v2(10.67,36.83)
D9: length 36.5
  Top Layer w0.381: CARD1.42 24.82,37.26 v2(24.38,36.83)
  Bottom Layer w0.305: v2(6,11.87) 6,12.1 6.6,12.7 6.6,22.22 21.21,36.83 v2(24.38,36.83)
DDR: length 41.3
  Top Layer w0.381: CARD1.48 27.22,37.55 27.43,37.34 v2(27.43,35.94)
  Bottom Layer w0.305: v2(7,8.87) 7.1,8.87 8.51,10.29 8.51,21.72 21.18,34.39 26.13,34.39 27.43,35.69 v2(27.43,35.94)
IO_VDD: length 47.8
  Top Layer w0.381: v1(4,6.87) 2.18,6.87 2.16,6.89 ; U1.H10 v1(13,4.87) 13.43,4.44 C9.2
  Top Layer w0.508: R15.2 14.07,25.65 C8.2 15.88,25.65 v1(17.4,24.13)
  Bottom Layer w0.381: v1(7,9.87) 6.57,9.87 6,9.3 v1(6,7.87) 4.7,7.87 4,7.18 v1(4,6.87) 4,4.7 4.38,4.32 12.45,4.32 13,4.87
  Bottom Layer w0.508: v1(13,4.87) 13.59,5.46 13.59,9.4 18.03,13.84 18.03,20.07 17.4,20.7 v1(17.4,24.13)
IOPROC_EN: length 38.9
  Top Layer w0.381: CARD1.51 29.17,31.24 v2(29.34,31.24)
  Bottom Layer w0.305: v2(10,6.87) 10,7.08 11.28,8.36 11.28,22.2 20.32,31.24 v2(29.34,31.24)
LOCKED: length 36.8
  Top Layer w0.305: v2(21.21,28.96) 21.22,28.97 CARD1.33
  Bottom Layer w0.305: v2(21.21,28.96) 20.9,29.26 19.86,29.26 12.19,21.59 12.19,7.87 12.83,7.24 12.83,5.84 11.94,4.95 7.35,4.95 7,5.3 v2(7,5.87)
PCLK: length 37
  Top Layer w0.381: v2(25.4,35.94) 25.4,36.96 25.62,37.17 CARD1.44
  Bottom Layer w0.305: v2(25.4,35.94) 21.21,35.94 7.24,21.97 7.24,12.11 v2(7,11.87)
RESET#: length 37
  Top Layer w0.381: 27.18,28.32 26.67,28.32 v2(26.02,28.97) CARD1.45
  Bottom Layer w0.305: v2(11,6.87) 11,7.19 11.73,7.92 11.73,21.9 20.57,30.73 24.26,30.73 v2(26.02,28.97)
SDO: length 12.2
  Top Layer w0.305: U1.C10 13.54,10.87 14.35,11.68 20.45,11.68 21.97,13.21 21.97,15.5 R10.1
SDO#: length 22.7
  Top Layer w0.305: U1.D10 16.48,9.87 v2(17.02,10.41)
  Top Layer w0.381: v2(29.21,15.49) R13.1
  Top Layer w0.559: R13.1 R12.1
  Bottom Layer w0.305: v2(17.02,10.41) 28.57,10.41 29.46,11.3 29.46,15.24 v2(29.21,15.49)
SMPTE_BYPASS#: length 38.7
  Top Layer w0.381: v2(27.69,32) 27.62,31.93 CARD1.49
  Bottom Layer w0.305: v2(9,6.87) 9,6.97 10.82,8.79 10.82,22.5 20.32,32 v2(27.69,32)
$1N18162: length 1.3
  Top Layer w0.533: C26.1 R6.1
$1N18693: length 3.5
  Top Layer w0.381: U1.A8 11.93,13.8 12.7,13.8 13.59,14.7 C27.1
$1N18791: length 3.6
  Top Layer w0.381: C28.2 12.18,14.68 R6.2 10,13.63 U1.A7
$1N19933: length 4.4
  Top Layer w0.381: v1(9.78,14.82) 9.64,14.68 R7.2
  Bottom Layer w0.381: v1(10,11.87) 10,14.6 v1(9.78,14.82)
$1N24621: length 2.3
  Top Layer w0.381: R9.1 14.22,7.87 U1.F10
$1N26341: length 3
  Top Layer w0.787: C30.2 25.31,12.77 RF1.1
$2N832: length 1.2
  Top Layer w0.305: U2.7 5.89,23.24 C3.1
$2N1175: length 2.7
  Top Layer w0.305: R1.1 4.7,21.97 4.7,22.99 5.39,23.68 U2.6

## Copper pours and planes (outline as drawn; the poured copper is in the pictures)
+3V3 on Top Layer: 23.43,31.99 24.64,31.99 24.64,29.46 23.43,29.46
+3V3 on Top Layer: 6.35,30.49 27.05,30.49 27.05,20.07 6.35,20.07
+3V3 on Top Layer: 19.51,27.14 21.68,27.14 21.68,24.07 19.51,24.07
GND on Top Layer: 21.78,31.52 23.03,31.52 23.03,29.48 21.78,29.48
GND on Top Layer: 9.78,27.18 11.62,27.18 11.62,26.35 9.78,26.35
GND on Top Layer: 18.37,27.12 19.2,27.12 19.2,25.29 18.37,25.29
GND on Top Layer: 0.76,33.15 3.94,33.15 3.94,29.08 0.76,29.08
GND on Top Layer: 30.1,33.02 33.15,33.02 33.15,29.08 30.1,29.08
GND on Top Layer: 29.65,27.38 31.83,27.38 31.83,24.92 29.65,24.92
GND on Top Layer: 19.49,22.53 21.75,22.53 21.75,20.76 19.49,20.76
GND on Top Layer: 22,27.13 22.82,27.13 22.82,25.3 22,25.3
GND on Inner1: 0.26,59.31 33.74,59.31 33.74,0.26 0.26,0.26
GND on Inner2: 0.26,59.31 33.74,59.31 33.74,0.26 0.26,0.26
SDO on Top Layer: 21.64,18.05 22.22,18.05 22.22,15.24 21.64,15.24
$1N26857 on Top Layer: 22.56,16.89 24.64,16.89 24.64,15.24 22.56,15.24

Small or netless copper shapes (teardrops, artwork), in the pictures only: 12 on Inner1, 12 on Inner2
